# Altium schematic sheet Microcontroller.SchDoc
size A4; SheetNumber: 1; SheetTotal: 5
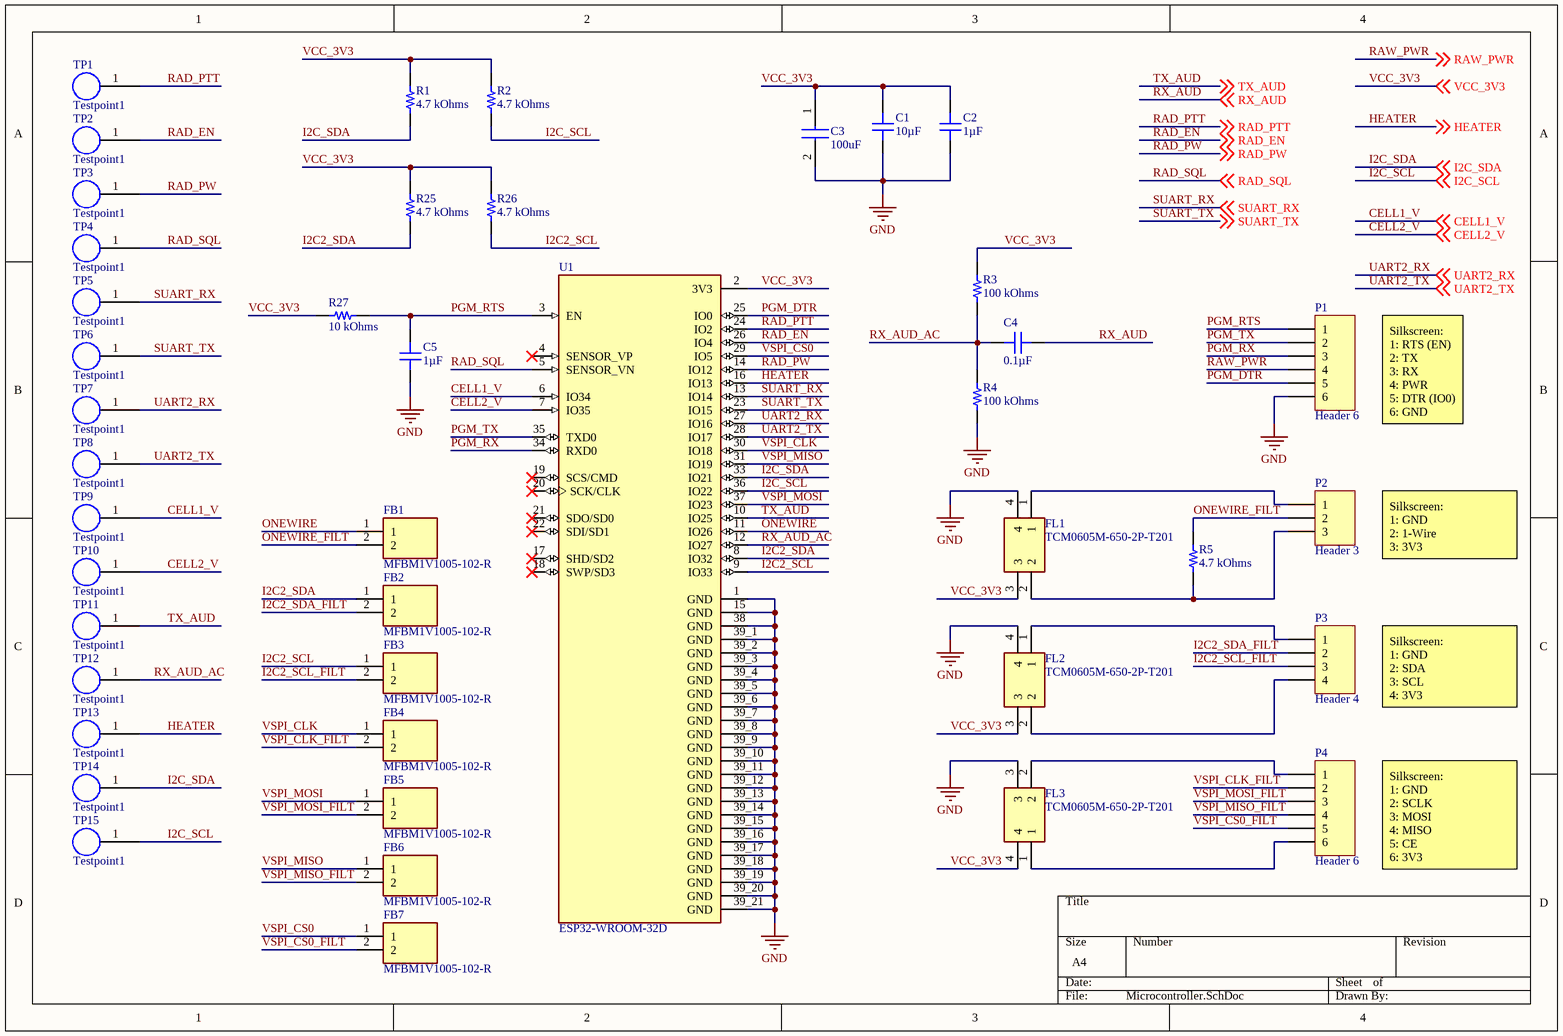
[diagram p0: Microcontroller.SchDoc]

## Parts
C1  10µF  [CAP 0402_1005]
C2  1µF  [CAP 0402_1005]
C3  100uF  [CAPC3225X270N]
C4  0.1µF  [CAP 0402_1005]
C5  1µF  [CAP 0402_1005]
FB1  MFBM1V1005-102-R  [BEADC1005X65N]
FB2  MFBM1V1005-102-R  [BEADC1005X65N]
FB3  MFBM1V1005-102-R  [BEADC1005X65N]
FB4  MFBM1V1005-102-R  [BEADC1005X65N]
FB5  MFBM1V1005-102-R  [BEADC1005X65N]
FB6  MFBM1V1005-102-R  [BEADC1005X65N]
FB7  MFBM1V1005-102-R  [BEADC1005X65N]
FL1  TCM0605M-650-2P-T201  [TCM0605M]
FL2  TCM0605M-650-2P-T201  [TCM0605M]
FL3  TCM0605M-650-2P-T201  [TCM0605M]
P1  Header 6  [HDR1X6]
P2  Header 3  [HDR1X3]
P3  Header 4  [HDR1X4]
P4  Header 6  [HDR1X6]
R1  4.7 kOhms  [RES 0402_1005]
R2  4.7 kOhms  [RES 0402_1005]
R3  100 kOhms  [RES 0402_1005]
R4  100 kOhms  [RES 0402_1005]
R5  4.7 kOhms  [RES 0402_1005]
R25  4.7 kOhms  [RES 0402_1005]
R26  4.7 kOhms  [RES 0402_1005]
R27  10 kOhms  [RES 0402_1005]
TP1  Testpoint1  [Testpoint1]  (no BOM)
TP2  Testpoint1  [Testpoint1]  (no BOM)
TP3  Testpoint1  [Testpoint1]  (no BOM)
TP4  Testpoint1  [Testpoint1]  (no BOM)
TP5  Testpoint1  [Testpoint1]  (no BOM)
TP6  Testpoint1  [Testpoint1]  (no BOM)
TP7  Testpoint1  [Testpoint1]  (no BOM)
TP8  Testpoint1  [Testpoint1]  (no BOM)
TP9  Testpoint1  [Testpoint1]  (no BOM)
TP10  Testpoint1  [Testpoint1]  (no BOM)
TP11  Testpoint1  [Testpoint1]  (no BOM)
TP12  Testpoint1  [Testpoint1]  (no BOM)
TP13  Testpoint1  [Testpoint1]  (no BOM)
TP14  Testpoint1  [Testpoint1]  (no BOM)
TP15  Testpoint1  [Testpoint1]  (no BOM)
U1  ESP32-WROOM-32D  [MODULE_ESP32-WROOM-32D]

## Nets
GND: C1.1 C2.1 C3.2 C5.1 FL1.4 FL2.4 FL3.3 P1.6 R4.1 U1.1(GND) U1.15(GND) U1.38(GND) U1.39_1(GND) U1.39_2(GND) U1.39_3(GND) U1.39_4(GND) U1.39_5(GND) U1.39_6(GND) U1.39_7(GND) U1.39_8(GND) U1.39_9(GND) U1.39_10(GND) U1.39_11(GND) U1.39_12(GND) U1.39_13(GND) U1.39_14(GND) U1.39_15(GND) U1.39_16(GND) U1.39_17(GND) U1.39_18(GND) U1.39_19(GND) U1.39_20(GND) U1.39_21(GND)
CELL1_V: TP9.1 U1.6(IO34) ; off-sheet CELL1_V
CELL2_V: TP10.1 U1.7(IO35) ; off-sheet CELL2_V
HEATER: TP13.1 U1.16(IO13) ; off-sheet HEATER
I2C2_SCL: FB3.1 R26.1 U1.9(IO33)
I2C2_SCL_FILT: FB3.2 P3.3
I2C2_SDA: FB2.1 R25.1 U1.8(IO32)
I2C2_SDA_FILT: FB2.2 P3.2
I2C_SCL: R2.1 TP15.1 U1.36(IO22) ; off-sheet I2C_SCL
I2C_SDA: R1.1 TP14.1 U1.33(IO21) ; off-sheet I2C_SDA
ONEWIRE: FB1.1 U1.11(IO26)
ONEWIRE_FILT: FB1.2 P2.2 R5.2
PGM_DTR: P1.5 U1.25(IO0)
PGM_RTS: C5.2 P1.1 R27.2 U1.3(EN)
PGM_RX: P1.3 U1.34(RXD0)
PGM_TX: P1.2 U1.35(TXD0)
RAD_EN: TP2.1 U1.26(IO4) ; off-sheet RAD_EN
RAD_PTT: TP1.1 U1.24(IO2) ; off-sheet RAD_PTT
RAD_PW: TP3.1 U1.14(IO12) ; off-sheet RAD_PW
RAD_SQL: TP4.1 U1.5(SENSOR_VN) ; off-sheet RAD_SQL
RAW_PWR: P1.4 ; off-sheet RAW_PWR
RX_AUD: C4.1 ; off-sheet RX_AUD
RX_AUD_AC: C4.2 R3.1 R4.2 TP12.1 U1.12(IO27)
SUART_RX: TP5.1 U1.13(IO14) ; off-sheet SUART_RX
SUART_TX: TP6.1 U1.23(IO15) ; off-sheet SUART_TX
TX_AUD: TP11.1 U1.10(IO25) ; off-sheet TX_AUD
UART2_RX: TP7.1 U1.27(IO16) ; off-sheet UART2_RX
UART2_TX: TP8.1 U1.28(IO17) ; off-sheet UART2_TX
VCC_3V3: C1.2 C2.2 C3.1 FL1.3 FL2.3 FL3.4 R1.2 R2.2 R3.2 R25.2 R26.2 R27.1 U1.2(3V3) ; off-sheet VCC_3V3
VSPI_CLK: FB4.1 U1.30(IO18)
VSPI_CLK_FILT: FB4.2 P4.2
VSPI_CS0: FB7.1 U1.29(IO5)
VSPI_CS0_FILT: FB7.2 P4.5
VSPI_MISO: FB6.1 U1.31(IO19)
VSPI_MISO_FILT: FB6.2 P4.4
VSPI_MOSI: FB5.1 U1.37(IO23)
VSPI_MOSI_FILT: FB5.2 P4.3
NetFL1_1: FL1.1 P2.1
NetFL1_2: FL1.2 P2.3 R5.1
NetFL2_1: FL2.1 P3.1
NetFL2_2: FL2.2 P3.4
NetFL3_1: FL3.1 P4.6
NetFL3_2: FL3.2 P4.1

Not connected (* = marked no-connect by the designer): U1 4(SENSOR_VP)* 17(SHD/SD2)* 18(SWP/SD3)* 19(SCS/CMD)* 20(SCK/CLK)* 21(SDO/SD0)* 22(SDI/SD1)*

## Notes on the sheet
- Silkscreen:
  1: RTS (EN)
  2: TX
  3: RX
  4: PWR
  5: DTR (IO0)
  6: GND
- Silkscreen:
  1: GND
  2: 1-Wire
  3: 3V3
- Silkscreen:
  1: GND
  2: SDA
  3: SCL
  4: 3V3
- Silkscreen:
  1: GND
  2: SCLK
  3: MOSI
  4: MISO
  5: CE
  6: 3V3

## Library data of the parts
C1 = C0402C106M9PAC7867: CAP CER 10UF 6.3V X5R 0402; Manufacturer: KEMET; Tolerance: ±20%; Part Number: C0402C106M9PAC7867; Value: 10µF; Applications: General Purpose; Capacitance: 10µF; ComponentLink1Description: Datasheet; ComponentLink1URL: https://api.kemet.com/component-edge/download/datasheet/C0402C106M9PAC7867.pdf; ComponentLink2Description: DigiKey Link; ComponentLink2URL: http://digikey.com/product-detail/en/kemet/C0402C106M9PAC7867/399-13069-1-ND/5767556; Device Package: 0402 (1005 Metric); LastUpdated: 2/9/2020 1:02:21 AM; Lifecycle Status: Active; Minimum Order: 1; Mounting Type: Surface Mount, MLCC; Operating Temperature: -55°C ~ 85°C; Package / Case: 0402 (1005 Metric); Packaging: TapeAndReel; PartId: 3087; Part Status: Active; Price: 0.13; Series: SMD Comm X5R; Size / Dimension: 0.039" L x 0.020" W (1.00mm x 0.50mm); Supplier 1: DigiKey; Supplier Part Number 1: 399-13069-1-ND; Temperature Coefficient: X5R; Thickness (Max): 0.028" (0.70mm); Voltage - Rated: 6.3V
C2 C5 = 0402YD105KAT2A: CAP CER 1UF 16V X5R 0402; Manufacturer: AVX Corporation; Tolerance: ±10%; Part Number: 0402YD105KAT2A; Value: 1µF; Applications: General Purpose; Capacitance: 1µF; ComponentLink1Description: Datasheet; ComponentLink1URL: http://datasheets.avx.com/cx5r.pdf; ComponentLink2Description: DigiKey Link; ComponentLink2URL: http://digikey.com/product-detail/en/avx-corporation/0402YD105KAT2A/478-10179-1-ND/6797606; Device Package: 0402 (1005 Metric); LastUpdated: 2/9/2020 1:02:22 AM; Lifecycle Status: Active; Minimum Order: 1; Mounting Type: Surface Mount, MLCC; Operating Temperature: -55°C ~ 85°C; Package / Case: 0402 (1005 Metric); Packaging: TapeAndReel; PartId: 2859; Part Status: Active; Price: 0.07; Series: -; Size / Dimension: 0.039" L x 0.020" W (1.00mm x 0.50mm); Supplier 1: DigiKey; Supplier Part Number 1: 478-10179-1-ND; Temperature Coefficient: X5R; Thickness (Max): 0.022" (0.55mm); Voltage - Rated: 16V
C3 = GRM32EC70J107ME15L: Capacitor; Manufacturer_Name: Murata Electronics; Datasheet Link: https://componentsearchengine.com//GRM32EC70J107ME15L.pdf; Height: 2.7mm; Mouser2 Part Number: 81-GRM32EC70J107ME5L; Mouser2 Price/Stock: https://www.mouser.com/Search/Refine.aspx?Keyword=81-GRM32EC70J107ME5L; Manufacturer_Part_Number: GRM32EC70J107ME15L
C4 = C0402C104K9PACTU: CAP CER 0.1UF 6.3V X5R 0402; Manufacturer: KEMET; Tolerance: ±10%; Part Number: C0402C104K9PACTU; Value: 0.1µF; Applications: General Purpose; Capacitance: 0.1µF; ComponentLink1Description: Datasheet; ComponentLink1URL: https://api.kemet.com/component-edge/download/datasheet/C0402C104K9PACTU.pdf; ComponentLink2Description: DigiKey Link; ComponentLink2URL: http://digikey.com/product-detail/en/kemet/C0402C104K9PACTU/399-3026-1-ND/447602; Device Package: 0402 (1005 Metric); LastUpdated: 2/9/2020 1:01:34 AM; Lifecycle Status: Active; Minimum Order: 1; Mounting Type: Surface Mount, MLCC; Operating Temperature: -55°C ~ 85°C; Package / Case: 0402 (1005 Metric); Packaging: TapeAndReel; PartId: 12742; Part Status: Active; Price: 0.01; Series: SMD Comm X5R; Size / Dimension: 0.039" L x 0.020" W (1.00mm x 0.50mm); Supplier 1: DigiKey; Supplier Part Number 1: 399-3026-1-ND; Temperature Coefficient: X5R; Thickness (Max): 0.022" (0.55mm); Voltage - Rated: 6.3V
FB1-FB7 = MFBM1V1005-102-R: Ferrite Bead; Manufacturer_Name: Eaton; Manufacturer_Part_Number: MFBM1V1005-101-R; Assembly Instruction: DNP; Datasheet Link: https://www.mouser.in/datasheet/2/87/eaton_mfbm1v1005_high_current_multilayer_ferrite_c-1890673.pdf; Height: 0.65mm
FL1-FL3 = TCM0605M-650-2P-T201: Filter; Manufacturer_Name: TDK; Assembly Instruction: DNP; Datasheet Link: https://product.tdk.com/system/files/dam/doc/product/emc/emc/cmf_cmc/catalog/cmf_commercial_signal_tcm0605m_en.pdf; Height: 0.35mm; Manufacturer_Part_Number: TCM0605M-650-2P-T201
P1 P4 = Header 6: Header, 6-Pin; LatestRevisionDate: 17-Jul-2002; LatestRevisionNote: Re-released for DXP Platform.; Publisher: Altium Limited
P2 = Header 3: Header, 3-Pin; LatestRevisionDate: 17-Jul-2002; LatestRevisionNote: Re-released for DXP Platform.; Publisher: Altium Limited
P3 = Header 4: Header, 4-Pin; LatestRevisionDate: 17-Jul-2002; LatestRevisionNote: Re-released for DXP Platform.; Publisher: Altium Limited
R1 R2 R25 R26 = CRCW04024K70JNEDC: RES SMD 4.7K OHM 5% 1/16W 0402; Manufacturer: Vishay Dale; Power (Watts): 0.063W, 1/16W; Temperature Coefficient: ±200ppm/°C; Part Number: CRCW04024K70JNEDC; Value: 4.7 kOhms; ComponentLink1Description: Datasheet; ComponentLink1URL: http://www.vishay.com/docs/28773/crcwce3.pdf; ComponentLink2Description: DigiKey Link; ComponentLink2URL: http://digikey.com/product-detail/en/vishay-dale/CRCW04024K70JNEDC/541-3974-1-ND/7928657; Composition: Thick Film; Device Package: 0402 (1005 Metric); Height - Seated (Max): 0.014" (0.35mm); LastUpdated: 2/9/2020 1:07:41 AM; Lifecycle Status: Active; Minimum Order: 1; Number of Terminations: 2; Operating Temperature: -55°C ~ 155°C; Package / Case: 0402 (1005 Metric); Packaging: CutTape; PartId: 15960; Part Status: Active; Price: 0.10; Resistance: 4.7 kOhms; Series: CRCW-C; Size / Dimension: 0.039" L x 0.020" W (1.00mm x 0.50mm); Supplier 1: DigiKey; Supplier Part Number 1: 541-3974-1-ND; Supplier Device Package: 0402; Tolerance: ±5%
R3 R4 = AC0402FR-07100KL: RES SMD 100K OHM 1% 1/16W 0402; Manufacturer: Yageo; Power (Watts): 0.063W, 1/16W; Temperature Coefficient: ±100ppm/°C; Part Number: AC0402FR-07100KL; Value: 100 kOhms; ComponentLink1Description: Datasheet; ComponentLink1URL: https://www.yageo.com/upload/media/product/productsearch/datasheet/rchip/PYu-AC_51_RoHS_L_7.pdf; ComponentLink2Description: DigiKey Link; ComponentLink2URL: http://digikey.com/product-detail/en/yageo/AC0402FR-07100KL/YAG3434CT-ND/6006283; Composition: Thick Film; Device Package: 0402 (1005 Metric); Features: Automotive AEC-Q200, Moisture Resistant; Height - Seated (Max): 0.015" (0.37mm); LastUpdated: 2/9/2020 1:07:50 AM; Lifecycle Status: Active; Minimum Order: 1; Number of Terminations: 2; Operating Temperature: -55°C ~ 155°C; Package / Case: 0402 (1005 Metric); Packaging: CutTape; PartId: 12047; Part Status: Active; Price: 0.10; Ratings: AEC-Q200; Resistance: 100 kOhms; Series: AC; Size / Dimension: 0.039" L x 0.020" W (1.00mm x 0.50mm); Supplier 1: DigiKey; Supplier Part Number 1: YAG3434CT-ND; Supplier Device Package: 0402; Tolerance: ±1%
R5 = CRCW04024K70JNEDC: RES SMD 4.7K OHM 5% 1/16W 0402; Manufacturer: Vishay Dale; Power (Watts): 0.063W, 1/16W; Temperature Coefficient: ±200ppm/°C; Assembly Instruction: DNP; Part Number: CRCW04024K70JNEDC; Value: 4.7 kOhms; ComponentLink1Description: Datasheet; ComponentLink1URL: http://www.vishay.com/docs/28773/crcwce3.pdf; ComponentLink2Description: DigiKey Link; ComponentLink2URL: http://digikey.com/product-detail/en/vishay-dale/CRCW04024K70JNEDC/541-3974-1-ND/7928657; Composition: Thick Film; Device Package: 0402 (1005 Metric); Height - Seated (Max): 0.014" (0.35mm); LastUpdated: 2/9/2020 1:07:41 AM; Lifecycle Status: Active; Minimum Order: 1; Number of Terminations: 2; Operating Temperature: -55°C ~ 155°C; Package / Case: 0402 (1005 Metric); Packaging: CutTape; PartId: 15960; Part Status: Active; Price: 0.10; Resistance: 4.7 kOhms; Series: CRCW-C; Size / Dimension: 0.039" L x 0.020" W (1.00mm x 0.50mm); Supplier 1: DigiKey; Supplier Part Number 1: 541-3974-1-ND; Supplier Device Package: 0402; Tolerance: ±5%
R27 = CPF0402B10KE1: RES SMD 10K OHM 0.1% 1/16W 0402; Manufacturer: TE Connectivity Passive Product; Power (Watts): 0.063W, 1/16W; Temperature Coefficient: ±25ppm/°C; Part Number: CPF0402B10KE1; Value: 10 kOhms; ComponentLink1Description: Datasheet; ComponentLink1URL: https://www.te.com/commerce/DocumentDelivery/DDEController?Action=srchrtrv&DocNm=1773200&DocType=DS&DocLang=English; ComponentLink2Description: DigiKey Link; ComponentLink2URL: http://digikey.com/product-detail/en/te-connectivity-passive-product/CPF0402B10KE1/A102579CT-ND/2729112; Composition: Thin Film; Device Package: 0402 (1005 Metric); Height - Seated (Max): 0.014" (0.35mm); LastUpdated: 2/9/2020 1:07:41 AM; Lifecycle Status: Active; Minimum Order: 1; Number of Terminations: 2; Operating Temperature: -55°C ~ 155°C; Package / Case: 0402 (1005 Metric); Packaging: TapeAndReel; PartId: 15889; Part Status: Active; Price: 0.13; Resistance: 10 kOhms; Series: CPF, Neohm; Size / Dimension: 0.039" L x 0.020" W (1.00mm x 0.50mm); Supplier 1: DigiKey; Supplier Part Number 1: A102579CT-ND; Supplier Device Package: 0402; Tolerance: ±0.1%
U1 = ESP32-WROOM-32D: Bluetooth, WiFi 802.11b/g/n, Bluetooth v4.2 + EDR, Class 1, 2 and 3 Transceiver Module 2.4GHz ~ 2.5GHz Integrated, Trace Surface Mount; MF: Espressif Systems; Price: None; Package: Module Espressif Systems; Availability: Unavailable; SnapEDA_Link: https://www.snapeda.com/parts/ESP32-WROOM-32D/Espressif%20Systems/view-part/2768115/?ref=snap; Value: *; MP: ESP32-WROOM-32D